# EAGLE design softstart (EAGLE 9.6.2)
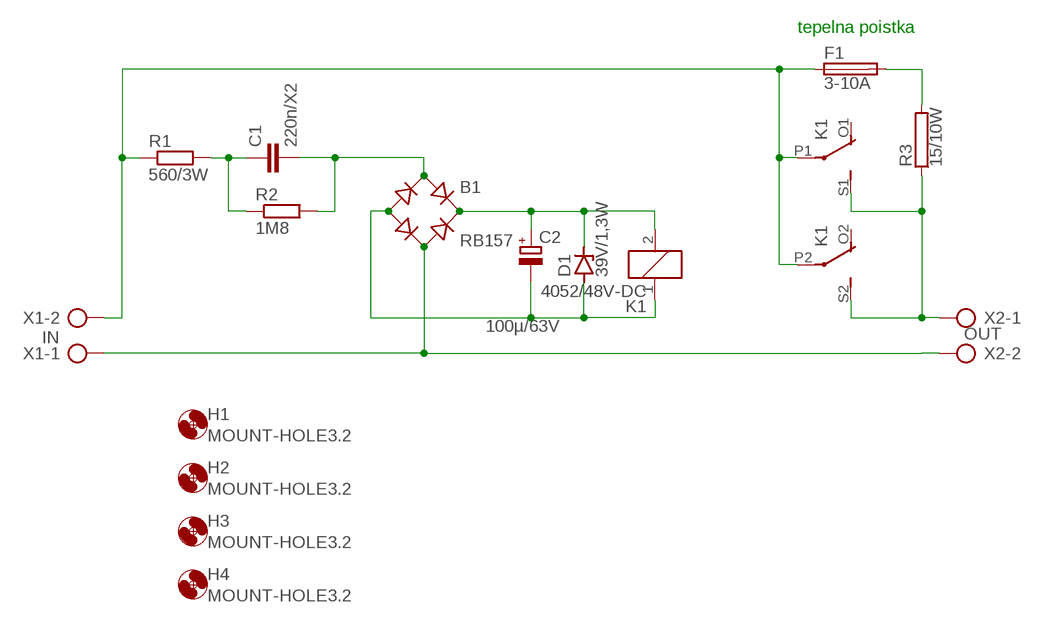
[diagram p0: schematic, sheet 1]

## Parts
B1  RB157  RB1A  [RB1A]
C1  220n/X2  C-EU150-072X183  [C150-072X183]
C2  100µ/63V  CPOL-EUE5-10.5  [E5-10,5]
D1  39V/1,3W  ZENER-DIODEDO35Z10  [DO35Z10]
F1  3-10A  TE5  [TE5]
H1  MOUNT-HOLE3.2  [3,2]
H2  MOUNT-HOLE3.2  [3,2]
H3  MOUNT-HOLE3.2  [3,2]
H4  MOUNT-HOLE3.2  [3,2]
K1  4052/48V-DC  4052  [F4052]
R1  560/3W  R-EU_0617/22  [0617/22]
R2  1M8  R-EU_0207/10  [0207/10]
R3  15/10W  RRWM10X49  [RWM10X49]
X1  IN  AK500/2  [AK500/2]
X2  OUT  AK500/2  [AK500/2]

## Nets
N$1: B1.+ C2.+ D1.C K1.2
N$2: B1.- C2.- D1.A K1.1
N$4: F1.2 R3.2
N$5: B1.AC1 C1.2 R2.2
N$7: C1.1 R1.2 R2.1
N$8: K1.S1(2:S) K1.S2(3:S) R3.1 X2.1
N$9: F1.1 K1.P1(2:P) K1.P2(3:P) R1.1 X1.2
N$11: B1.AC2 X1.1 X2.2
Unconnected: K1.O1(2:O) K1.O2(3:O)

## Notes on the sheet
- tepelna poistka

## Library data of the parts
B1 = rectifier2:RB1A: RECTIFIER 1 A
C1 = rcl-custom:C-EU: CAPACITOR, European symbol; SPICEPREFIX: C
C2 = rcl-custom:CPOL-EU: POLARIZED CAPACITOR, European symbol; SPICEPREFIX: C
D1 = diode:ZENER-DIODE: Z-Diode
F1 = fuse:TE5: FUSE Wickmann; OC_FARNELL: unknown; OC_NEWARK: unknown
H1-H4 = holes-custom:MOUNT-HOLE: MOUNTING HOLE with drill center marker
K1 = relay:4052: RELAY 2 x switch, Finder
R1 R2 = rcl-custom:R-EU_: RESISTOR, European symbol; SPICEPREFIX: R
R3 = resistor-power-custom:R: Power Resitor
X1 X2 = con-ptr500:AK500/2: CONNECTOR; OC_FARNELL: unknown; OC_NEWARK: unknown

## Board
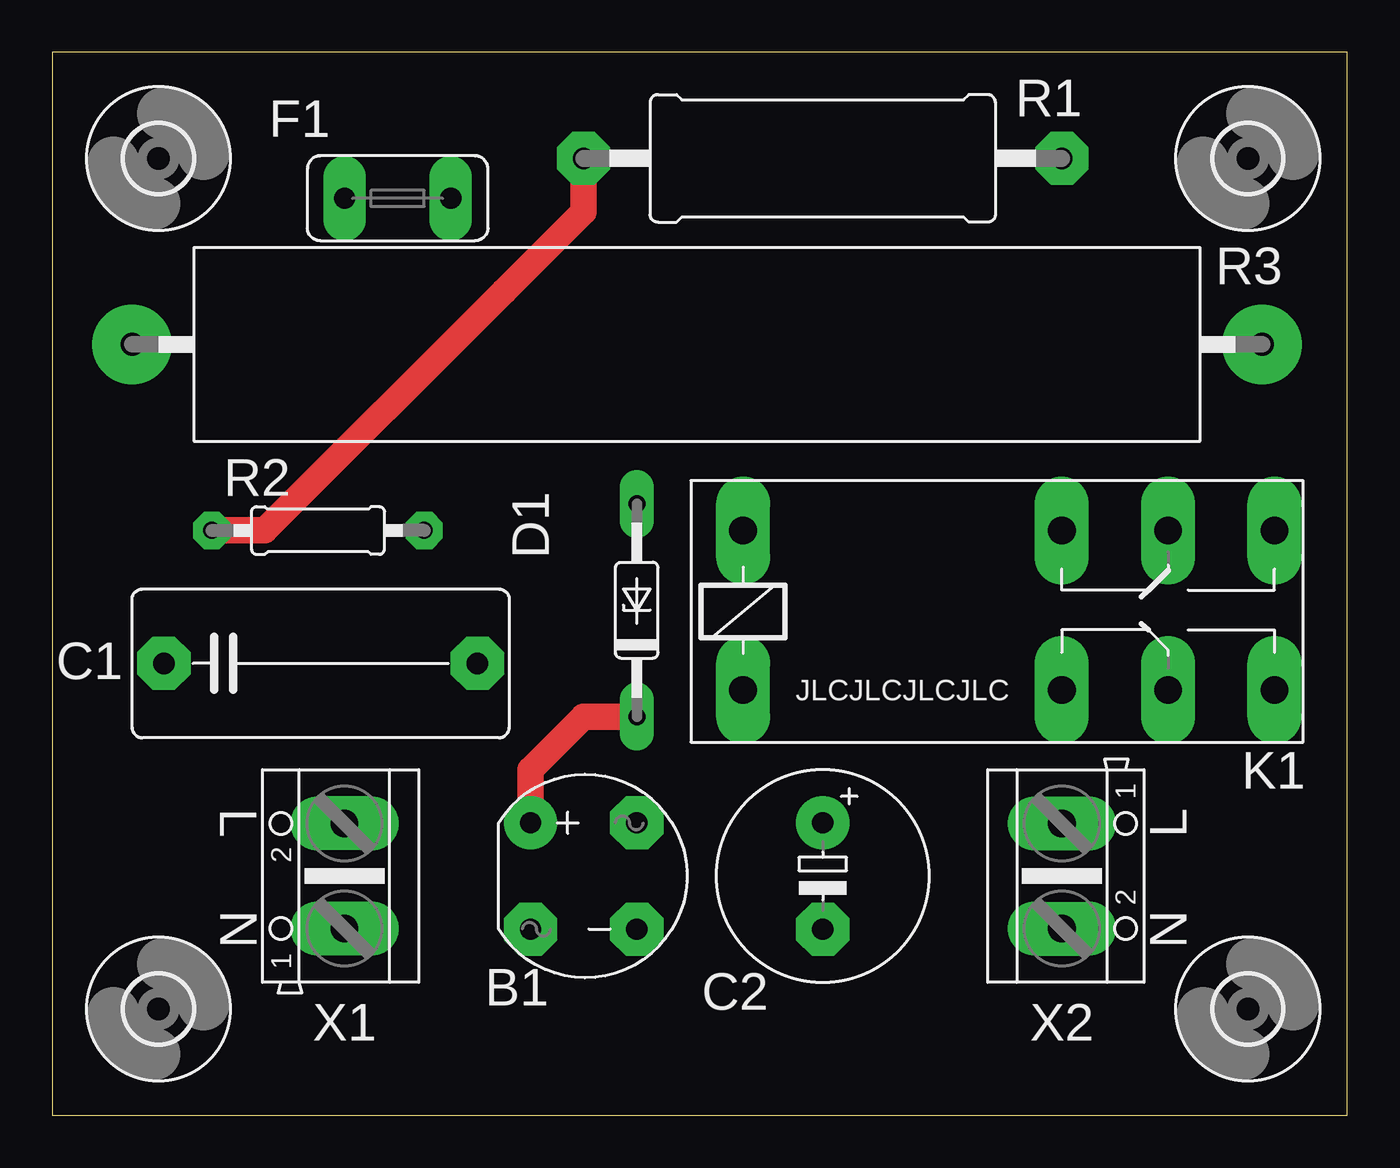
[diagram p1: board, top side]
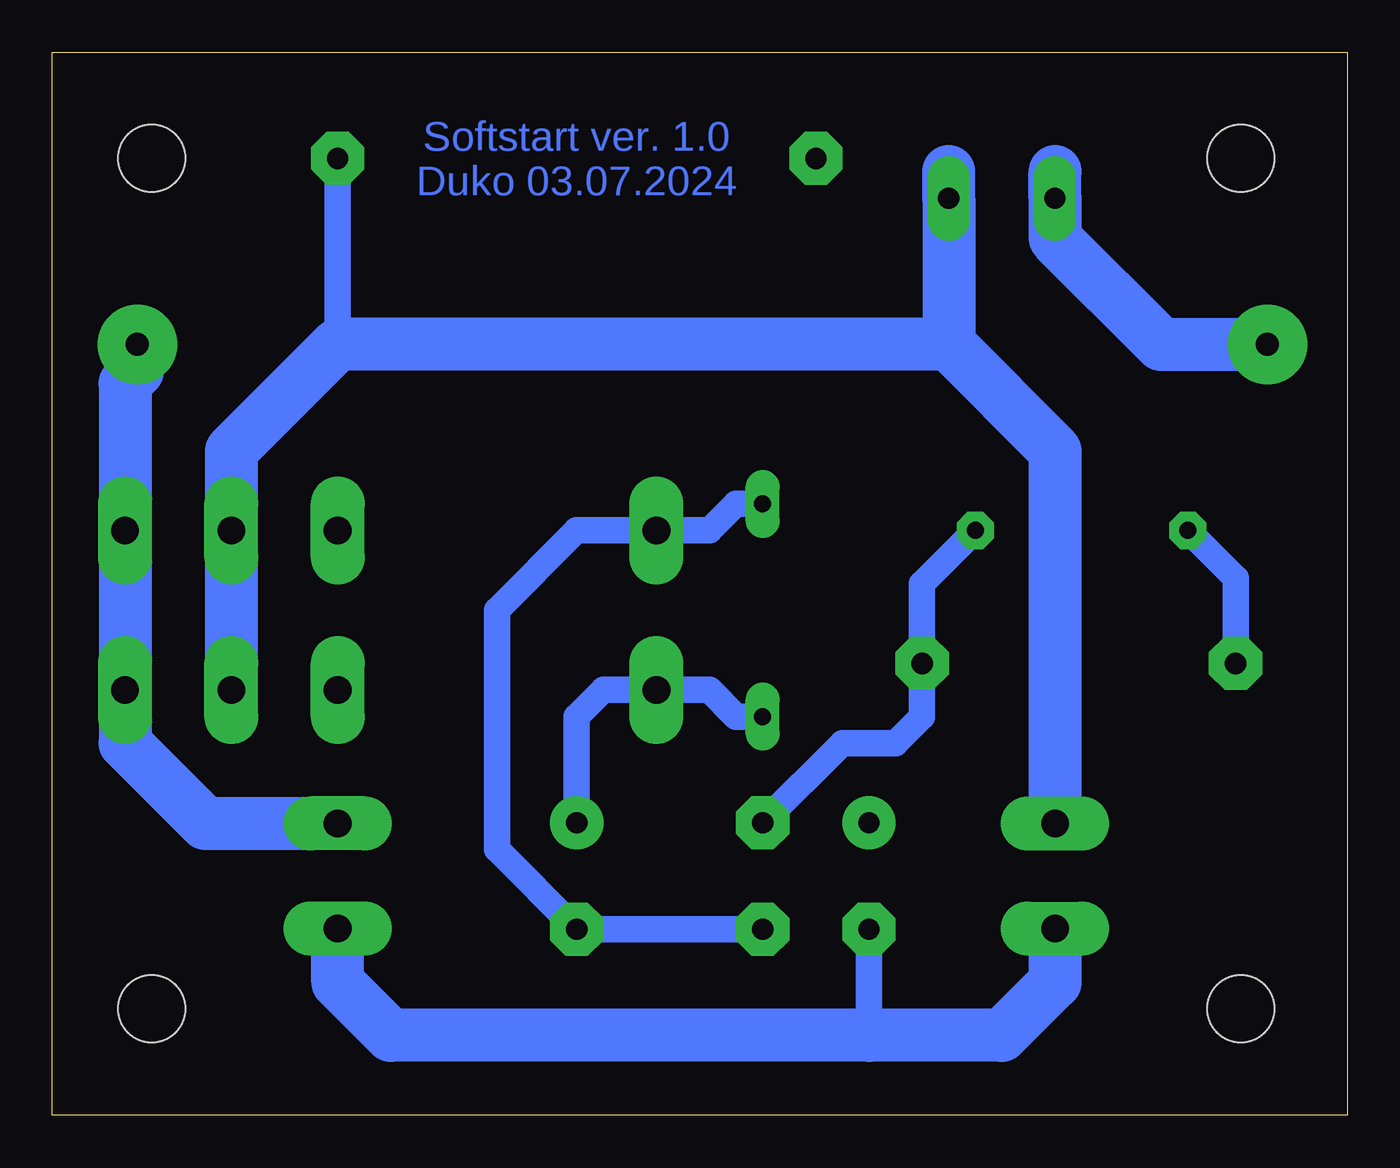
[diagram p2: board, bottom side, seen from below]

Size 61.9 x 50.79 mm. Coordinates in mm from the lower left corner, seen from the top.
Outline: 0,0 61.9,0 61.9,50.79 0,50.79 0,0
Copper layers (1*16): Top 0.035mm / dielectric 1.5mm / Bottom 0.035mm
Design rules "default *": minimum track width 6mil, minimum drill 0.35mm, track to track 6mil, track to pad 6mil, pad to pad 6mil, via to via 6mil, smd to smd 6mil, copper to edge 40mil, drill to drill 6mil, minimum pad ring 10mil, minimum via ring 8mil, stop-mask expansion 4mil, vias tented up to drill 0mil, thermal gap 10mil

### Footprints (pad centres in the part's own frame; a part is rotated, then mirrored left to right if it is on the bottom)
RB1A = drill 1.016 pad 2.54: + -2.54,2.54 | drill 1.016 pad 2.54 octagon: - 2.54,-2.54; AC1 2.54,2.54; AC2 -2.54,-2.54
C150-072X183 = drill 1.016 pad 2.54 octagon: 1 -7.493,0; 2 7.493,0
E5-10,5 = drill 1.016 pad 2.54: + -2.54,0 | drill 1.016 pad 2.54 octagon: - 2.54,0
DO35Z10 = drill 0.813 long: A 5.08,0; C -5.08,0
TE5 = drill 1.016 long: 1 -2.54,0; 2 2.54,0
3,2 = hole 3.2: 0,0
F4052 = drill 1.321 long: 1 -3.81,3.81; 2 -3.81,-3.81; O1 11.43,-3.81; O2 11.43,3.81; P1 16.51,-3.81; P2 16.51,3.81; S1 21.59,-3.81; S2 21.59,3.81
0617/22 = drill 1.016 pad 2.54 octagon: 1 -11.43,0; 2 11.43,0
0207/10 = drill 0.813 pad 1.778 octagon: 1 -5.08,0; 2 5.08,0
RWM10X49 = drill 1.1 pad 3.81: 1 -27.01,0; 2 27.01,0
AK500/2 = drill 1.321 long: 1 -2.515,0; 2 2.515,0

### Placement (x,y rotation side)
B1  25.4,11.43 0 top
C1  12.83,21.59 0 top
C2  36.83,11.43 270 top
D1  27.94,24.13 90 top
F1  16.51,43.81 180 top
H1  5.08,45.72 0 top
H2  57.15,45.72 0 top
H3  5.08,5.08 0 top
H4  57.15,5.08 0 top
K1  36.83,24.13 0 top
R1  36.83,45.72 180 top
R2  12.7,27.94 0 top
R3  30.82,36.83 180 top
X1  13.97,11.43 90 top
X2  48.26,11.43 270 top

### Tracks (layer width: path | path; a pad name or v marks a point on that pad's centre or on a via)
N$1
  Top 1.27: B1.+ 22.86,16.51 25.4,19.05 D1.C
  Bottom 1.27: D1.C 29.21,19.05 30.48,20.32 K1.2 35.56,20.32 36.83,19.05 C2.+
N$2
  Bottom 1.27: B1.- C2.- 40.64,12.7 40.64,24.13 36.83,27.94 K1.1 30.48,27.94 29.21,29.21 D1.A
N$4
  Bottom 2.54: R3.2 8.89,36.83 13.97,41.91 F1.2 13.97,45.09
N$5
  Bottom 1.27: R2.2 20.32,25.4 C1.2 20.32,19.05 21.59,17.78 24.13,17.78 B1.AC1
N$7
  Top 1.27: R1.2 25.4,43.18 21.59,39.37 10.16,27.94 R2.1
  Bottom 1.27: R2.1 5.33,25.65 C1.1
N$8
  Bottom 2.54: X2.1 54.59,13.95 58.42,17.78 K1.S1 K1.S2 58.42,34.97 57.83,35.56 R3.1
N$9
  Bottom 1.27: R1.1 48.26,36.83
  Bottom 2.54: 19.05,36.83 48.26,36.83 53.34,31.75 K1.P2 K1.P1 | 19.05,36.83 F1.1 19.05,45.09 | 19.05,36.83 13.97,31.75 X1.2
N$11
  Bottom 1.27: B1.AC2 22.86,3.81
  Bottom 2.54: X1.1 13.97,6.35 16.51,3.81 22.86,3.81 45.72,3.81 48.26,6.35 X2.2

### Text on the board
Bottom: Softstart ver. 1.0 / Duko 03.07.2024
tNames: JLCJLCJLCJLC | L | L | N | N